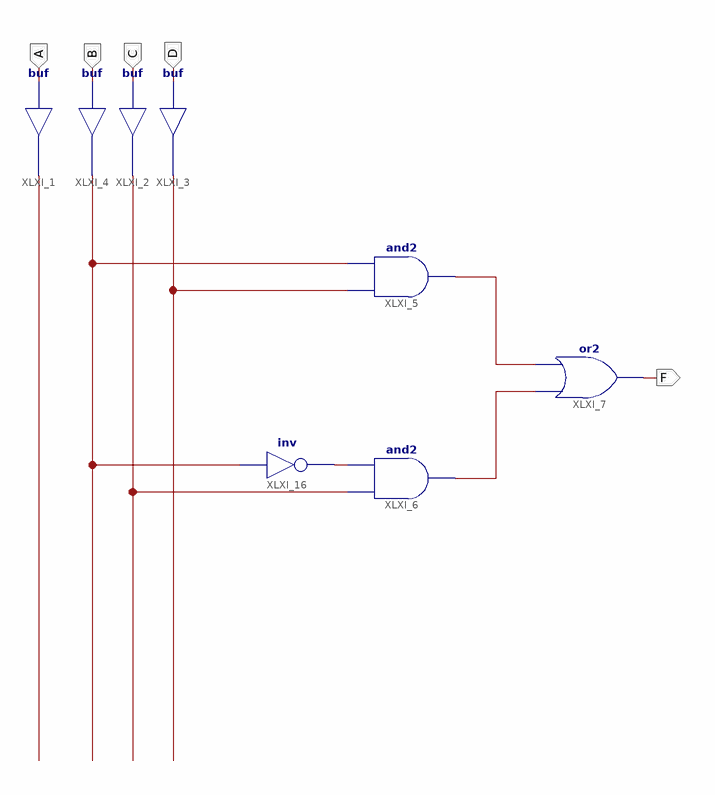
[diagram p0: schematic sheet 1]
// Xilinx ISE schematic Prime_Bcd_Detector.sch (spartan3e) as structural Verilog: 8 symbols, 5 ports
module Prime_Bcd_Detector (
  input  A,
  input  B,
  input  C,
  input  D,
  output F
);

  wire XLXN_1, XLXN_2, XLXN_3, XLXN_4, XLXN_6, XLXN_7, XLXN_15;

  buf XLXI_1 (XLXN_2, A);
  buf XLXI_2 (XLXN_3, C);
  buf XLXI_3 (XLXN_4, D);
  buf XLXI_4 (XLXN_1, B);
  or XLXI_7 (F, XLXN_7, XLXN_6);
  and XLXI_5 (XLXN_6, XLXN_4, XLXN_1);
  and XLXI_6 (XLXN_7, XLXN_3, XLXN_15);
  not XLXI_16 (XLXN_15, XLXN_1);
endmodule
